# Altium schematic sheet Varistors.SchDoc
size A4
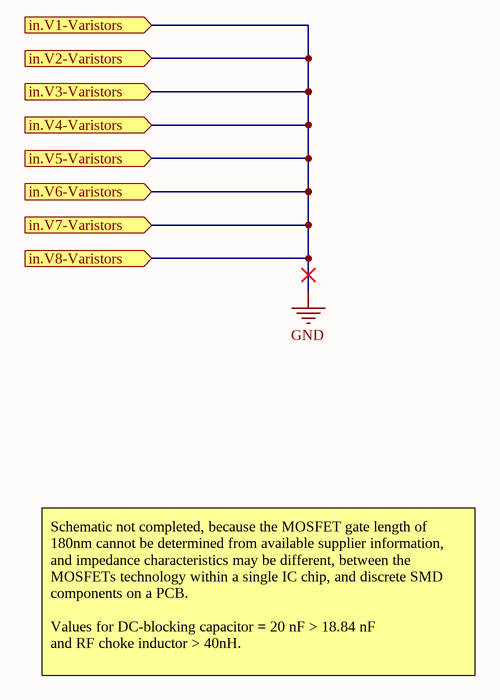
[diagram p0: Varistors.SchDoc]

## Ports
in.V1-Varistors (in), in.V2-Varistors (in), in.V3-Varistors (in), in.V4-Varistors (in), in.V5-Varistors (in), in.V6-Varistors (in), in.V7-Varistors (in), in.V8-Varistors (in)

## Nets
GND: port in.V1-Varistors, port in.V2-Varistors, port in.V3-Varistors, port in.V4-Varistors, port in.V5-Varistors, port in.V6-Varistors, port in.V7-Varistors, port in.V8-Varistors

## Notes on the sheet
- Schematic not completed, because the MOSFET gate length of 180nm cannot be determined from available supplier information, and impedance characteristics may be different, between the MOSFETs technology within a single IC chip, and discrete SMD components on a PCB.
  Values for DC-blocking capacitor = 20 nF > 18.84 nF
  and RF choke inductor > 40nH.